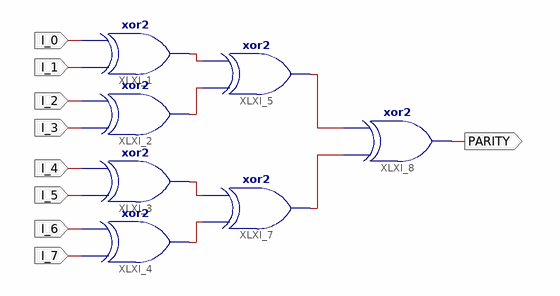
[diagram p0: schematic sheet 1]
// Xilinx ISE schematic Parity_gen.sch (spartan3e) as structural Verilog: 7 symbols, 9 ports
module Parity_gen (
  input  I_0,
  input  I_1,
  input  I_2,
  input  I_3,
  input  I_4,
  input  I_5,
  input  I_6,
  input  I_7,
  output PARITY
);

  wire XLXN_1, XLXN_3, XLXN_4, XLXN_6, XLXN_7, XLXN_10;

  xor XLXI_1 (XLXN_1, I_1, I_0);
  xor XLXI_2 (XLXN_7, I_3, I_2);
  xor XLXI_3 (XLXN_3, I_5, I_4);
  xor XLXI_4 (XLXN_6, I_7, I_6);
  xor XLXI_5 (XLXN_4, XLXN_7, XLXN_1);
  xor XLXI_7 (XLXN_10, XLXN_6, XLXN_3);
  xor XLXI_8 (PARITY, XLXN_10, XLXN_4);
endmodule
